# EAGLE design Quadromotor_BoosterPack_v1 (EAGLE 6.5.0)
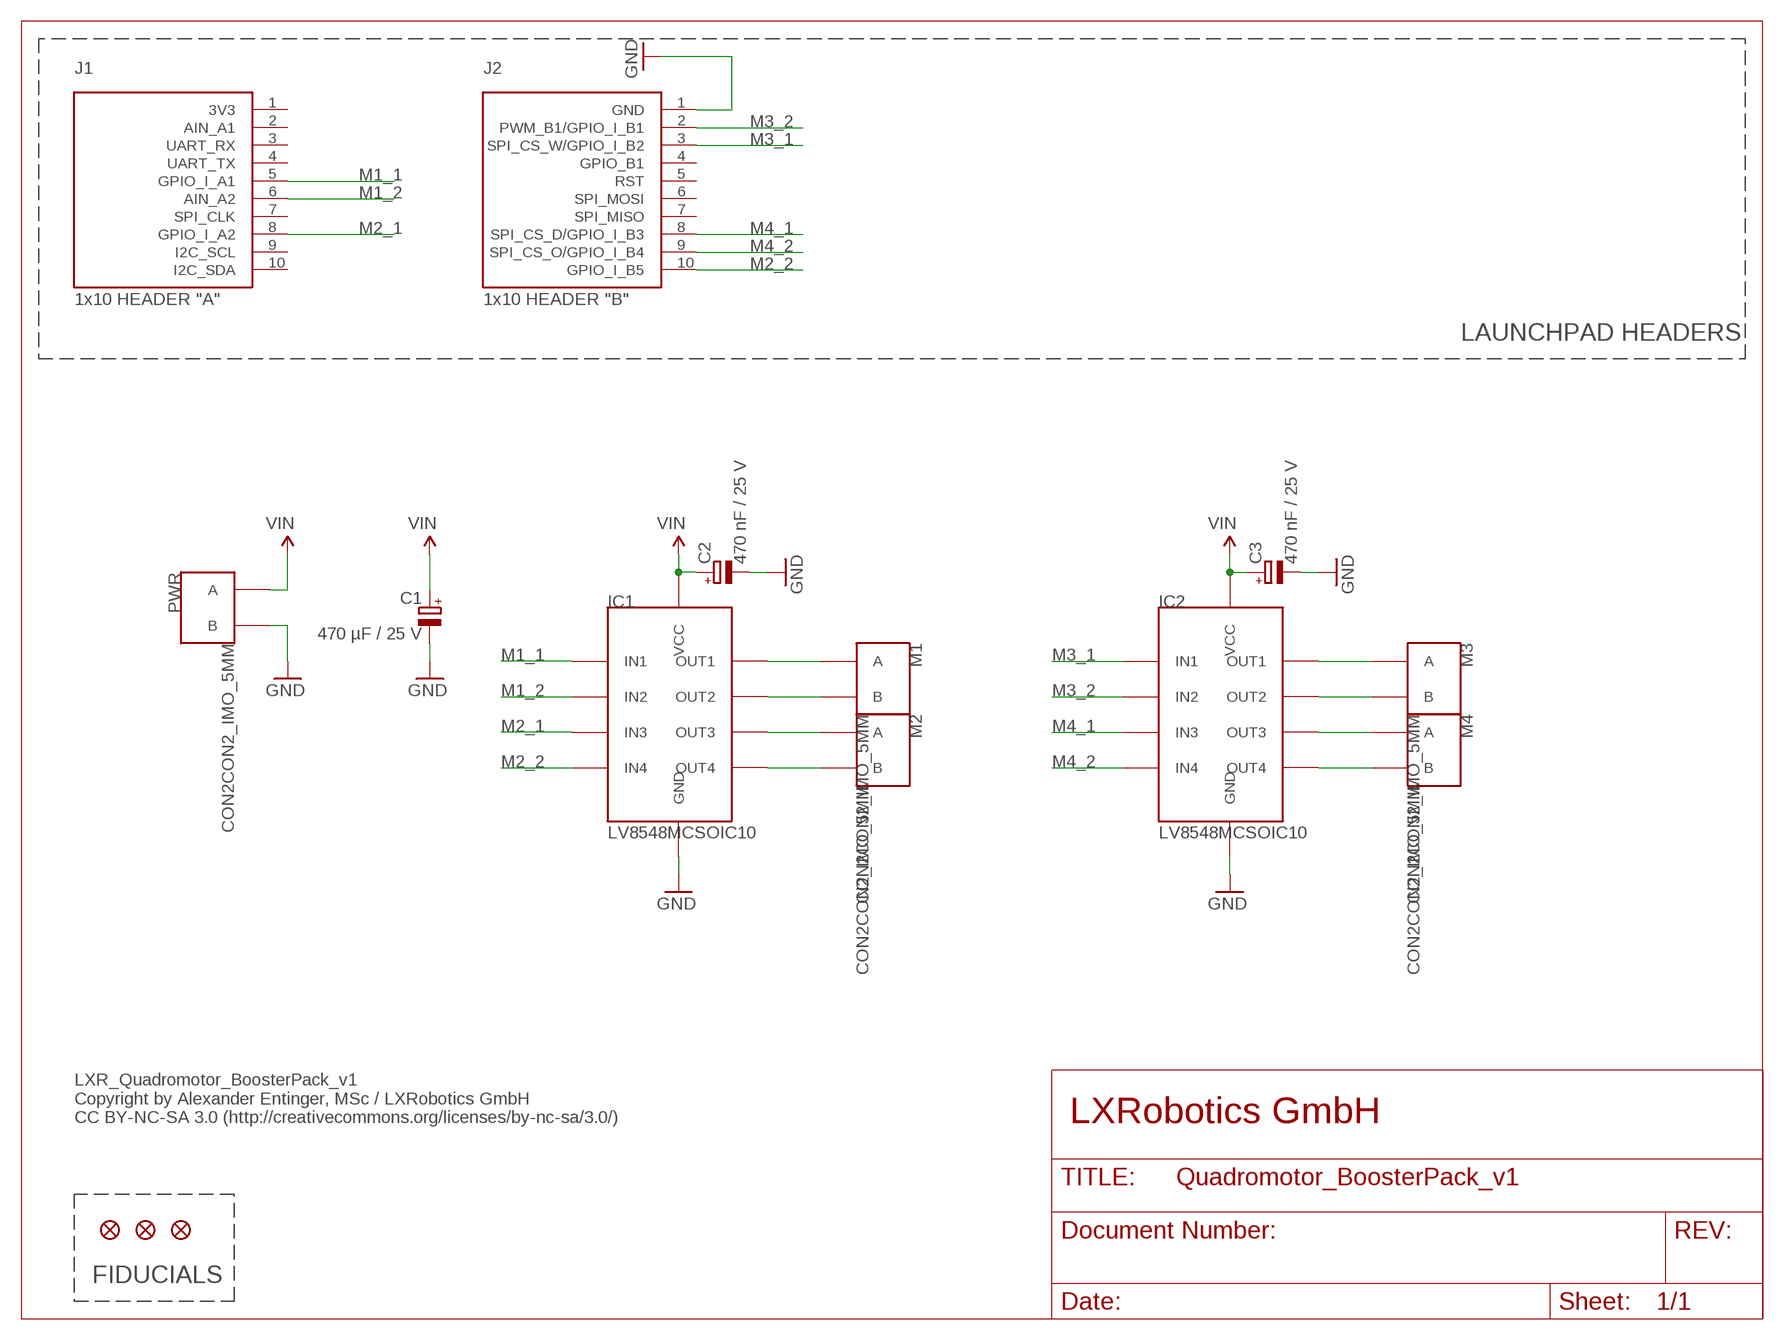
[diagram p0: schematic, sheet 1]

## Parts
C1  470 µF / 25 V  CPOL-EUE5-10.5  [E5-10,5]
C2  470 nF / 25 V  CPOL-EU  [KEMET_A]
C3  470 nF / 25 V  CPOL-EU  [KEMET_A]
FID1  FIDUCIAL  [FIDUCIAL_L10]
FID2  FIDUCIAL  [FIDUCIAL_L10]
FID3  FIDUCIAL  [FIDUCIAL_L10]
IC1  LV8548MCSOIC10  [SOIC10]
IC2  LV8548MCSOIC10  [SOIC10]
J1  1x10 HEADER "A"  HEADER-1X10-J1  [1X10]
J2  1x10 HEADER "B"  HEADER-1X10-J2  [1X10]
M1  CON2CON2_IMO_5MM  [CON2_IMO]
M2  CON2CON2_IMO_5MM  [CON2_IMO]
M3  CON2CON2_IMO_5MM  [CON2_IMO]
M4  CON2CON2_IMO_5MM  [CON2_IMO]
PWR  CON2CON2_IMO_5MM  [CON2_IMO]

## Nets
GND: C1.- C2.CATHODE(-) C3.CATHODE(-) IC1.6(GND) IC2.6(GND) J2.1(GND) PWR.P$2(B)
M1_1: IC1.2(IN1) J1.5(GPIO_I_A1)
M1_2: IC1.3(IN2) J1.6(AIN_A2)
M2_1: IC1.4(IN3) J1.8(GPIO_I_A2)
M2_2: IC1.5(IN4) J2.10(GPIO_I_B5)
M3_1: IC2.2(IN1) J2.3(SPI_CS_W/GPIO_I_B2)
M3_2: IC2.3(IN2) J2.2(PWM_B1/GPIO_I_B1)
M4_1: IC2.4(IN3) J2.8(SPI_CS_D/GPIO_I_B3)
M4_2: IC2.5(IN4) J2.9(SPI_CS_O/GPIO_I_B4)
N$1: IC1.10(OUT1) M1.P$1(A)
N$2: IC1.9(OUT2) M1.P$2(B)
N$3: IC1.8(OUT3) M2.P$1(A)
N$4: IC1.7(OUT4) M2.P$2(B)
N$5: IC2.10(OUT1) M3.P$1(A)
N$6: IC2.9(OUT2) M3.P$2(B)
N$7: IC2.8(OUT3) M4.P$1(A)
N$8: IC2.7(OUT4) M4.P$2(B)
VIN: C1.+ C2.ANODE(+) C3.ANODE(+) IC1.1(VCC) IC2.1(VCC) PWR.P$1(A)
Unconnected: J1.1(3V3) J1.2(AIN_A1) J1.3(UART_RX) J1.4(UART_TX) J1.7(SPI_CLK) J1.9(I2C_SCL) J1.10(I2C_SDA) J2.4(GPIO_B1) J2.5(RST) J2.6(SPI_MOSI) J2.7(SPI_MISO)

## Notes on the sheet
- LAUNCHPAD HEADERS
- LXR_Quadromotor_BoosterPack_v1 
  Copyright by Alexander Entinger, MSc / LXRobotics GmbH
  CC BY-NC-SA 3.0 (http://creativecommons.org/licenses/by-nc-sa/3.0/)
- LXRobotics GmbH
- FIDUCIALS

## Library data of the parts
C1 = resistor:CPOL-EU: POLARIZED CAPACITOR, European symbol
C2 C3 = lxrobotics:CPOL-EU: POLARIZED CAPACITOR, European symbol
FID1-FID3 = CCo-Boost:FIDUCIAL: Fiducial Alignment Points Various fiducial points for machine vision alignment.
IC1 IC2 = lxrobotics:LV8548MC
J1 = CCo-Boost:HEADER-1X10-J1: 1x10 BoosterPack Header J1 This 1x10 header matches the pinout of J1 header of the BoosterPack Pinout Standard.
J2 = CCo-Boost:HEADER-1X10-J2: 1x10 BoosterPack Header J2 This 1x10 header matches the pinout of J2 header of the BoosterPack Pinout Standard.
M1-M4 PWR = lxrobotics:CON2

## Board
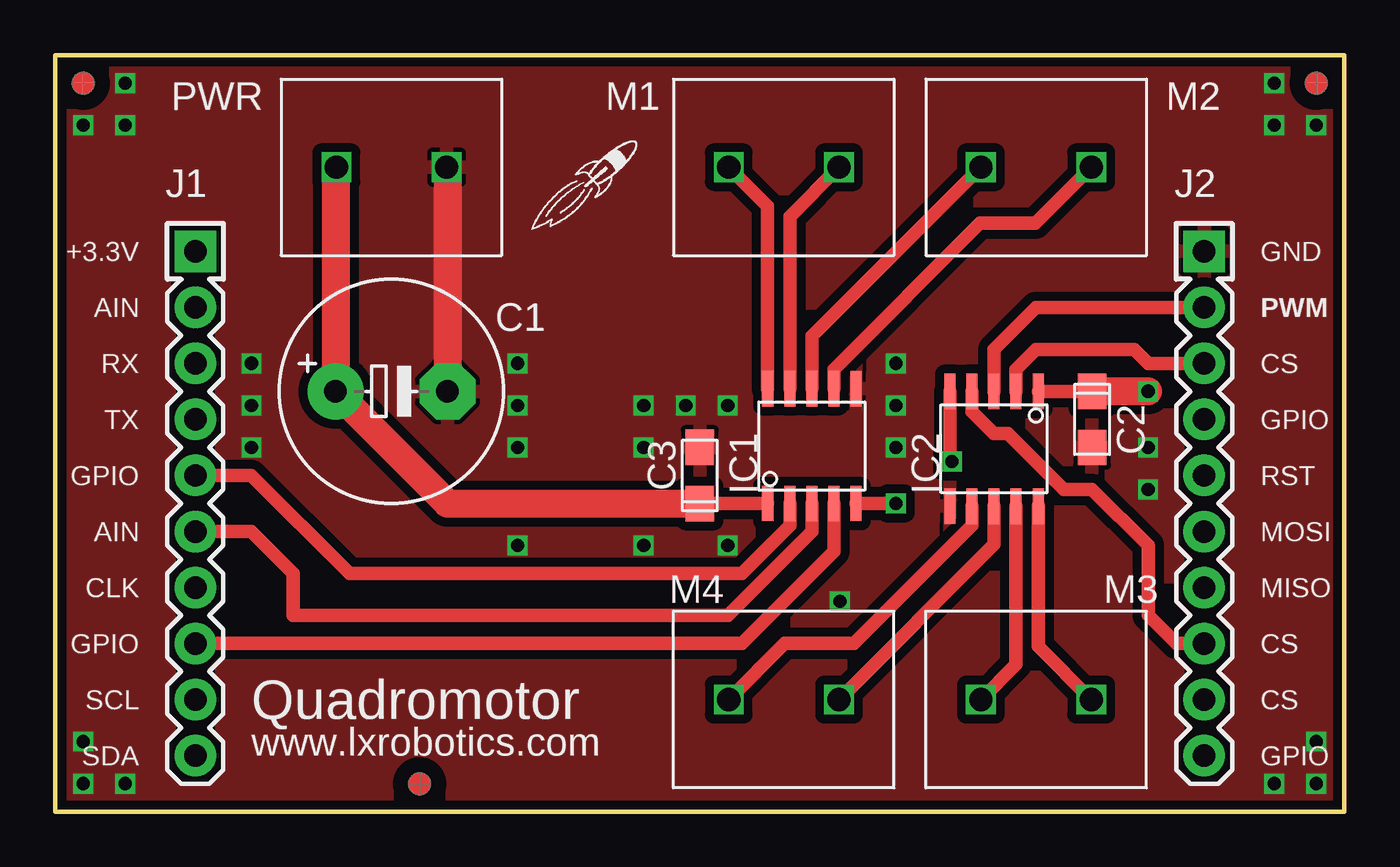
[diagram p1: board, top side]
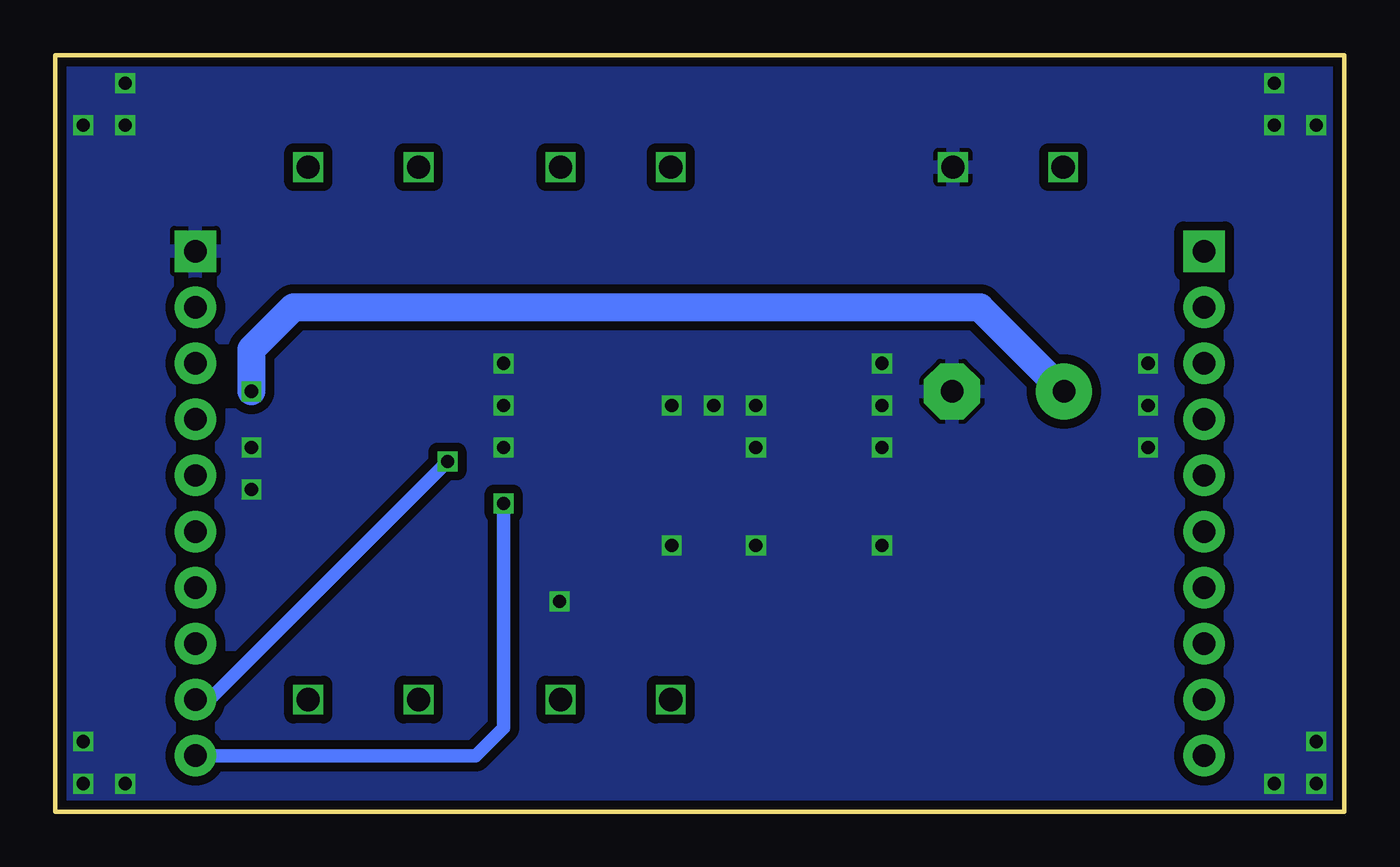
[diagram p2: board, bottom side, seen from below]

Size 58.42 x 34.29 mm. Coordinates in mm from the lower left corner, seen from the top.
Outline: 0,0 58.42,0 58.42,34.29 0,34.29 0,0
Copper layers (1*16): Top 0.035mm / dielectric 1.5mm / Bottom 0.035mm
Design rules "LeitOn - Standard-Eagle-DRU - 1- und  2-Lagen DK - deutsch - Rev 2.0": minimum track width 0.15mm, minimum drill 0.3mm, track to track 0.15mm, track to pad 0.15mm, pad to pad 0.15mm, via to via 0.15mm, smd to smd 0.15mm, copper to edge 0.3mm, drill to drill 0.3mm, minimum pad ring 0.15mm, minimum via ring 0.15mm, stop-mask expansion 0.075mm, vias tented up to drill 0mil, thermal gap 0.2mm

### Footprints (pad centres in the part's own frame; a part is rotated, then mirrored left to right if it is on the bottom)
E5-10,5 = drill 1.016 pad 2.54: + -2.54,0 | drill 1.016 pad 2.54 octagon: - 2.54,0
KEMET_A = smd 1.6 x 1.3: ANODE 1.275,0; CATHODE -1.275,0
SOIC10 = smd 0.5 x 1.6: 1 -2,0; 2 -1,0; 3 0,0; 4 1,0; 5 2,0; 6 2,5.2; 7 1,5.2; 8 0,5.2; 9 -1,5.2; 10 -2,5.2
1X10 = drill 1.016 pad 1.88 square: 1 0,10.16 | drill 1.016 pad 1.88: 2 0,7.62; 3 0,5.08; 4 0,2.54; 5 0,0; 6 0,-2.54; 7 0,-5.08; 8 0,-7.62; 9 0,-10.16; 10 0,-12.7
CON2_IMO = drill 1.05 square: P$1 -2.5,0; P$2 2.5,0

### Placement (x,y rotation side)
C1  15.24,19.05 0 top
C2  46.99,17.78 90 top
C3  29.21,15.24 270 top
FID1  1.27,33.02 0 top
FID2  57.15,33.02 0 top
FID3  16.51,1.27 0 top
IC1  34.29,13.97 0 top
IC2  42.55,19.05 180 top
J1  6.35,15.24 0 top
J2  52.07,15.24 0 top
M1  33.02,29.21 0 top
M2  44.45,29.21 0 top
M3  44.45,5.08 180 top
M4  33.02,5.08 180 top
PWR  15.24,29.21 0 top
U$1  [LOGO-ROCKET]  24.13,28.57 0 top

### Tracks (layer width: path | path; a pad name or v marks a point on that pad's centre or on a via)
GND  (via drill 0.6)
  Top 1.27: PWR.P$2 17.78,29.17 C1.-
  other vias: 26.67,18.41 26.67,16.51 28.57,18.41 30.48,18.41 49.53,16.51 49.53,14.61 3.17,1.27 1.27,1.27 1.27,3.17 1.27,31.11 3.17,31.11 3.17,33.02 55.24,33.02 55.24,31.11 57.15,31.11 57.15,3.17 57.15,1.27 55.24,1.27 35.56,9.53 38.1,16.51 38.1,18.41 38.1,20.32 20.95,12.06 26.67,12.06 30.48,12.06 20.95,16.51 20.95,18.41 20.95,20.32 8.89,16.51 8.89,18.41 8.89,20.32
  pour Top (isolate 0.406): 0.64,0.64 57.78,0.64 57.78,33.66 0.64,33.66
  pour Bottom (isolate 0.406): 0.64,0.64 57.78,0.64 57.78,33.66 0.64,33.66
M1_1
  Top 0.61: J1.5 8.89,15.24 13.34,10.79 31.11,10.79 33.29,12.97 IC1.2
M1_2
  Top 0.61: IC1.3 34.29,12.7 30.48,8.89 10.79,8.89 10.79,10.79 8.89,12.7 J1.6
M2_1
  Top 0.61: J1.8 31.11,7.62 35.29,11.79 IC1.4
M2_2  (via drill 0.6)
  Top 0.61: v38.1,13.97 IC1.5
  Bottom 0.61: J2.10 39.37,2.54 38.1,3.81 v38.1,13.97
M3_1
  Top 0.61: J2.3 49.53,20.32 48.9,20.95 44.45,20.95 43.55,20.05 IC2.2
M3_2
  Top 0.61: J2.2 44.45,22.86 42.55,20.95 IC2.3
M4_1
  Top 0.61: J2.8 50.8,7.62 49.53,8.89 49.53,12.06 46.99,14.61 45.72,14.61 43.18,17.14 42.55,17.14 41.55,18.14 IC2.4
M4_2  (via drill 0.6)
  Top 0.61: v40.64,15.88 40.55,15.97 IC2.5
  Bottom 0.61: J2.9 51.44,5.08 v40.64,15.88
N$1
  Top 0.61: IC1.10 32.29,27.44 M1.P$1
N$2
  Top 0.61: IC1.9 33.29,26.98 M1.P$2
N$3
  Top 0.61: IC1.8 34.29,21.55 M2.P$1
N$4
  Top 0.61: IC1.7 35.29,20.05 41.91,26.67 44.41,26.67 M2.P$2
N$5
  Top 0.61: IC2.10 44.55,7.49 M3.P$1
N$6
  Top 0.61: IC2.9 43.55,6.67 M3.P$2
N$7
  Top 0.61: IC2.8 42.55,12.11 M4.P$1
N$8
  Top 0.61: IC2.7 41.55,12.97 36.2,7.62 33.06,7.62 M4.P$2
VIN  (via drill 0.6)
  Top 0.61: IC2.1 C2.ANODE | C3.ANODE IC1.1
  Top 1.27: PWR.P$1 12.7,29.17 C1.+ 17.78,13.97 C3.ANODE | v49.53,19.05 v49.52,19.05 C2.ANODE
  Bottom 1.27: C1.+ 16.51,22.86 47.62,22.86 49.53,20.95 v49.53,19.05

### Text on the board
tPlace: +3.3V | GND | AIN | PWM | RX | CS | TX | GPIO | GPIO | RST | AIN | MOSI | CLK | MISO | GPIO | CS | SCL | Quadromotor | CS | SDA | www.lxrobotics.com | GPIO